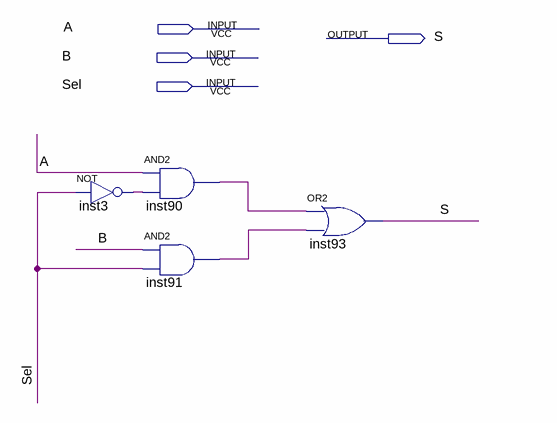
[diagram p0: schematic sheet]
// Quartus schematic MUX_2_1.bdf as structural Verilog: 4 symbols, 4 pins
module MUX_2_1 (
  input  A,
  input  B,
  input  Sel,
  output S
);

  wire inst3_out, inst90_out, inst91_out;

  not inst3 (inst3_out, Sel);
  and inst90 (inst90_out, A, inst3_out);
  and inst91 (inst91_out, B, Sel);
  or inst93 (S, inst90_out, inst91_out);
endmodule
